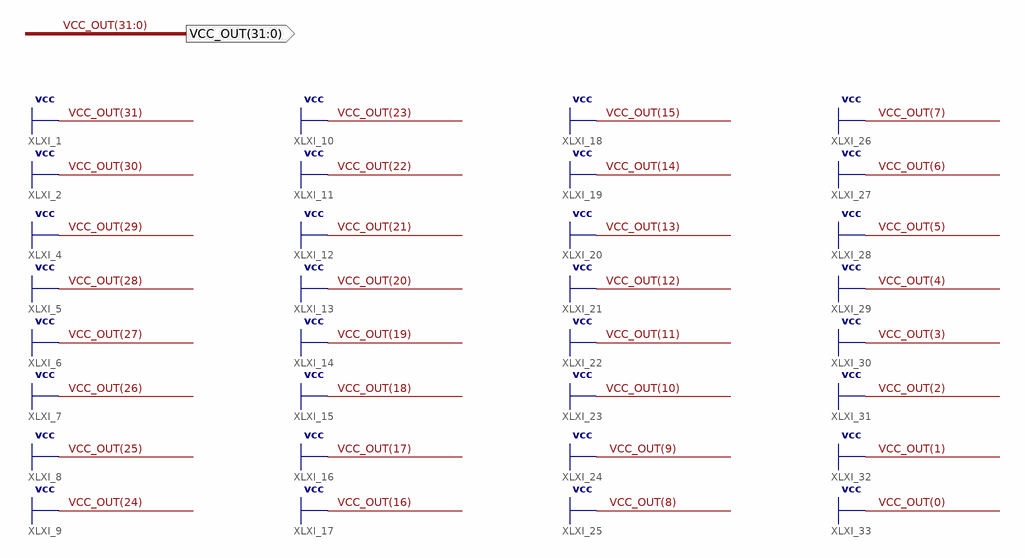
[diagram p0: schematic sheet 1]
// Xilinx ISE schematic VCC_32.sch (artix7) as structural Verilog: 0 symbols, 1 ports
module VCC_32 (
  output [31:0] VCC_OUT
);


  assign VCC_OUT = {32{1'b1}};
endmodule
